# EAGLE design sqm-dis (EAGLE 6.4)
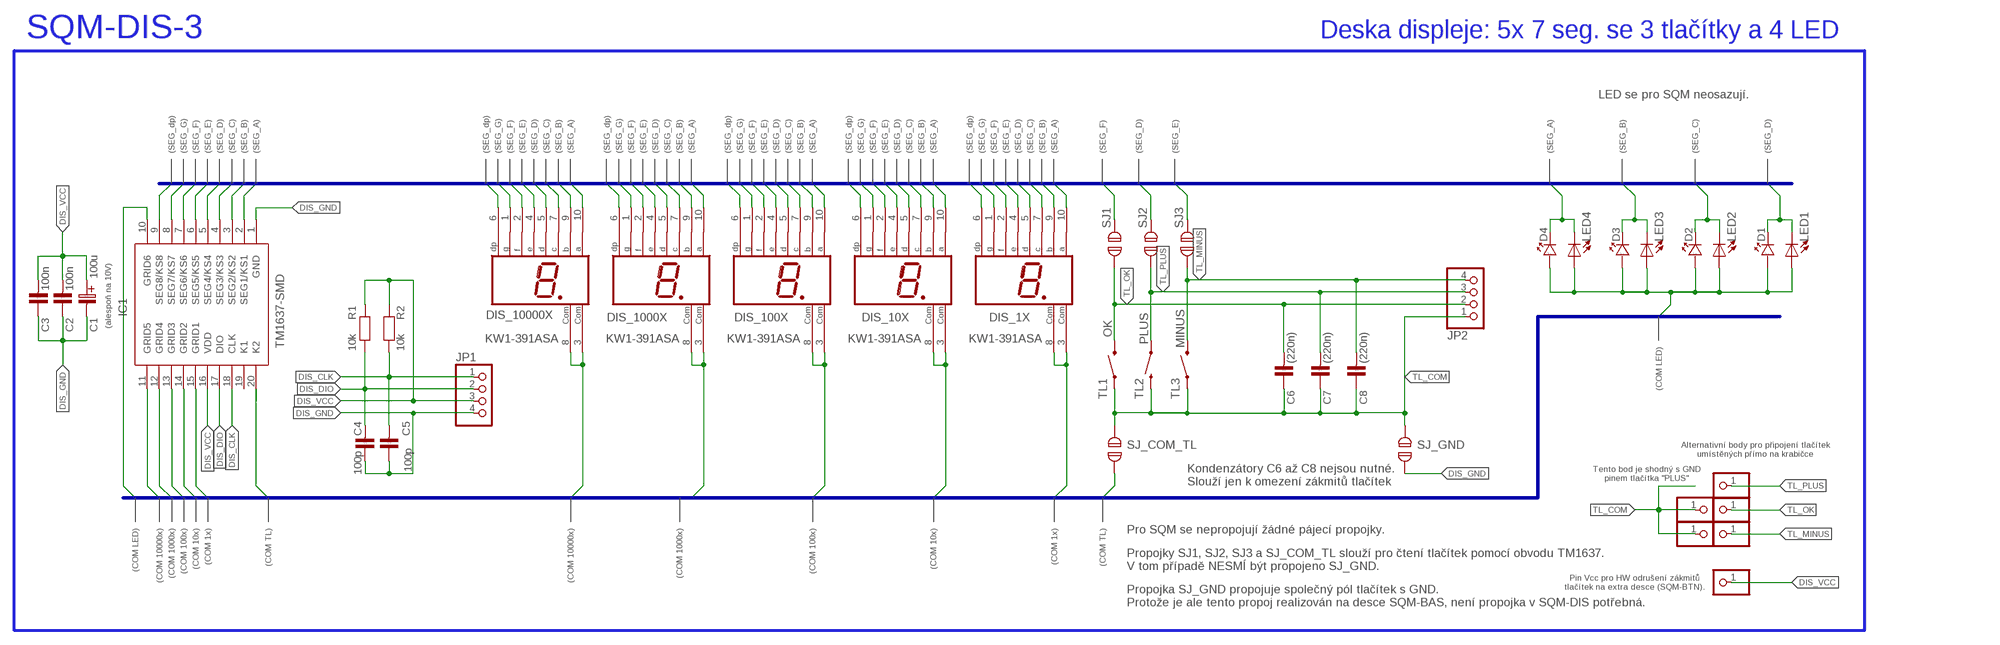
[diagram p0: schematic, sheet 1]

## Parts
C1  100u  C-ELEKTROLYT_2,5  [C-EL_2,5]
C2  100n  C-KERAMIK_SMD_0805  [0805]
C3  100n  C-KERAMIK_SMD_0805  [0805]
C4  100p  C-KERAMIK_SMD_0805  [0805]
C5  100p  C-KERAMIK_SMD_0805  [0805]
C6  (220n)  C-KERAMIK_SMD_0805  [0805]
C7  (220n)  C-KERAMIK_SMD_0805  [0805]
C8  (220n)  C-KERAMIK_SMD_0805  [0805]
D1  LED_3  [LED_3]
D2  LED_3  [LED_3]
D3  LED_3  [LED_3]
D4  LED_3  [LED_3]
DIS_1X  KW1-391ASA  SC39-11SRWA  [HDSP-E]
DIS_10X  KW1-391ASA  SC39-11SRWA  [HDSP-E]
DIS_100X  KW1-391ASA  SC39-11SRWA  [HDSP-E]
DIS_1000X  KW1-391ASA  SC39-11SRWA  [HDSP-E]
DIS_10000X  KW1-391ASA  SC39-11SRWA  [HDSP-E]
IC1  TM1637-SMD  TM1637__SOP_  [SOIC127P1045X280-20N]
JP1  PINHD-1X4  [1X04]
JP2  PINHD-1X4  [1X04]
JP3  PINHD-1X1  [1X01]
JP4  PINHD-1X1  [1X01]
JP5  PINHD-1X1  [1X01]
JP6  PINHD-1X1  [1X01]
JP7  PINHD-1X1  [1X01]
JP8  PINHD-1X1  [1X01]
LED1  LEDCHIP-LED0805  [CHIP-LED0805]
LED2  LEDCHIP-LED0805  [CHIP-LED0805]
LED3  LEDCHIP-LED0805  [CHIP-LED0805]
LED4  LEDCHIP-LED0805  [CHIP-LED0805]
R1  10k  R_SMD_0805  [0805]
R2  10k  R_SMD_0805  [0805]
SJ1  SJ  SOLDERJUMPER  [SJ_2S-NO]
SJ2  SJ  SOLDERJUMPER  [SJ_2S-NO]
SJ3  SJ  SOLDERJUMPER  [SJ_2S-NO]
SJ_COM_TL  SJ  SOLDERJUMPER  [SJ_2S-NO]
SJ_GND  SJ  SOLDERJUMPER  [SJ_2S-NO]
TL1  OK  MOMENTARY-SWITCH-SPST-PTH-6.0MM  [TACTILE_SWITCH_PTH_6.0MM]
TL2  PLUS  MOMENTARY-SWITCH-SPST-PTH-6.0MM  [TACTILE_SWITCH_PTH_6.0MM]
TL3  MINUS  MOMENTARY-SWITCH-SPST-PTH-6.0MM  [TACTILE_SWITCH_PTH_6.0MM]

## Nets
COM_BUS0: DIS_1X.3(COM) DIS_1X.8(COM) IC1.15(GRID1)
COM_BUS1: DIS_10X.3(COM) DIS_10X.8(COM) IC1.14(GRID2)
COM_BUS2: DIS_100X.3(COM) DIS_100X.8(COM) IC1.13(GRID3)
COM_BUS3: DIS_1000X.3(COM) DIS_1000X.8(COM) IC1.12(GRID4)
COM_BUS4: DIS_10000X.3(COM) DIS_10000X.8(COM) IC1.11(GRID5)
COM_BUS5: IC1.20(K2) SJ_COM_TL.1
COM_BUS6: D1.A D2.A D3.A D4.A IC1.10(GRID6) LED1.A LED2.A LED3.A LED4.A
DIS_CLK: C5.2 IC1.18(CLK) JP1.1 R2.1
DIS_DIO: C4.2 IC1.17(DIO) JP1.2 R1.1
DIS_GND: C1.C-(C_EL-) C2.1 C3.1 C4.1 C5.1 IC1.1(GND) JP1.4 SJ_GND.1
DIS_VCC: C1.C+(C_EL+) C2.2 C3.2 IC1.16(VDD) JP1.3 JP3.1 R1.2 R2.2
SEG_BUS0: D4.K DIS_1X.10(A) DIS_10X.10(A) DIS_100X.10(A) DIS_1000X.10(A) DIS_10000X.10(A) IC1.2(SEG1/KS1) LED4.C
SEG_BUS1: D3.K DIS_1X.9(B) DIS_10X.9(B) DIS_100X.9(B) DIS_1000X.9(B) DIS_10000X.9(B) IC1.3(SEG2/KS2) LED3.C
SEG_BUS2: D2.K DIS_1X.7(C) DIS_10X.7(C) DIS_100X.7(C) DIS_1000X.7(C) DIS_10000X.7(C) IC1.4(SEG3/KS3) LED2.C
SEG_BUS3: D1.K DIS_1X.5(D) DIS_10X.5(D) DIS_100X.5(D) DIS_1000X.5(D) DIS_10000X.5(D) IC1.5(SEG4/KS4) LED1.C SJ2.2
SEG_BUS4: DIS_1X.4(E) DIS_10X.4(E) DIS_100X.4(E) DIS_1000X.4(E) DIS_10000X.4(E) IC1.6(SEG5/KS5) SJ3.2
SEG_BUS5: DIS_1X.2(F) DIS_10X.2(F) DIS_100X.2(F) DIS_1000X.2(F) DIS_10000X.2(F) IC1.7(SEG6/KS6) SJ1.2
SEG_BUS6: DIS_1X.1(G) DIS_10X.1(G) DIS_100X.1(G) DIS_1000X.1(G) DIS_10000X.1(G) IC1.8(SEG7/KS7)
SEG_BUS7: DIS_1X.6(DP) DIS_10X.6(DP) DIS_100X.6(DP) DIS_1000X.6(DP) DIS_10000X.6(DP) IC1.9(SEG8/KS8)
TL_COM: C6.1 C7.1 C8.1 JP2.1 JP7.1 JP8.1 SJ_COM_TL.2 SJ_GND.2 TL1.1 TL2.3 TL3.1
TL_MINUS: C8.2 JP2.4 JP6.1 SJ3.1 TL3.3
TL_OK: C6.2 JP2.2 JP4.1 SJ1.1 TL1.3
TL_PLUS: C7.2 JP2.3 JP5.1 SJ2.1 TL2.1
Unconnected: IC1.19(K1)

## Buses
SEG_BUS[0..7]
COM_BUS[0..6]

## Notes on the sheet
- SQM-DIS-3 | Deska displeje: 5x 7 seg. se 3 tlačítky a 4 LED
- LED se pro SQM neosazují.
- (SEG_dp) | (SEG_G) | (SEG_F) | (SEG_E) | (SEG_D) | (SEG_C) | (SEG_B) | (SEG_A) | (SEG_dp) | (SEG_G) | (SEG_F) | (SEG_E) | (SEG_D) | (SEG_C) | (SEG_B) | (SEG_A) | (SEG_dp) | (SEG_G) | (SEG_F) | (SEG_E) | (SEG_D) | (SEG_C) | (SEG_B) | (SEG_A) | (SEG_dp) | (SEG_G) | (SEG_F) | (SEG_E) | (SEG_D) | (SEG_C) | (SEG_B) | (SEG_A) | (SEG_dp) | (SEG_G) | (SEG_F) | (SEG_E) | (SEG_D) | (SEG_C) | (SEG_B) | (SEG_A) | (SEG_dp) | (SEG_G) | (SEG_F) | (SEG_E) | (SEG_D) | (SEG_C) | (SEG_B) | (SEG_A) | (SEG_F) | (SEG_D) | (SEG_E) | (SEG_A) | (SEG_B) | (SEG_C) | (SEG_D)
- SJ1 | SJ2 | SJ3
- (alespoň na 10V)
- (COM LED)
- SJ_COM_TL | SJ_GND
- Alternativní body pro připojení tlačítek
  umístěných přímo na krabičce
- Tento bod je shodný s GND
  pinem tlačítka "PLUS"
- Kondenzátory C6 až C8 nejsou nutné.
  Slouží jen k omezení zákmitů tlačítek
- (COM LED) | (COM 10000x) | (COM 1000x) | (COM 100x) | (COM 10x) | (COM 1x) | (COM TL) | (COM 10000x) | (COM 1000x) | (COM 100x) | (COM 10x) | (COM 1x) | (COM TL)
- Pro SQM se nepropojují žádné pájecí propojky.
- Propojky SJ1, SJ2, SJ3 a SJ_COM_TL slouží pro čtení tlačítek pomocí obvodu TM1637.
  V tom případě NESMÍ být propojeno SJ_GND.
- Pin Vcc pro HW odrušení zákmitů
  tlačítek na extra desce (SQM-BTN).
- Propojka SJ_GND propojuje společný pól tlačítek s GND.
  Protože je ale tento propoj realizován na desce SQM-BAS, není propojka v SQM-DIS potřebná.

## Library data of the parts
C1 = #PaJa_30:C-ELEKTROLYT: Kondenzator - elektrolyticky
C2-C8 = #PaJa_30:C-KERAMIK: Kondenzator - keramicky
D1-D4 = #PaJa_30:LED: LED - jednobarevna
DIS_1X DIS_10X DIS_100X DIS_1000X DIS_10000X = display-hp:SC39-11SRWA: SINGLE DIGIT NUMERIC DISPLAY 9.9mm (0.39INCH) Source: SC39-11SRWA.pdf; OC_FARNELL: unknown; OC_NEWARK: unknown
IC1 = TM1637__SOP_:TM1637__SOP_: LED Drive Control Special Circuit Source: Datasheet <https://www.mcielectronics.cl/website_MCI/static/documents/Datasheet_TM1637.pdf>; DESCRIPTION: LED Drive Control Special Circuit; HEIGHT: 2.8mm; MANUFACTURER_NAME: TITAN MICRO ELECTRONICS; MANUFACTURER_PART_NUMBER: TM1637 (SOP)
JP1 JP2 = pinhead:PINHD-1X4: PIN HEADER
JP3-JP8 = pinhead:PINHD-1X1: PIN HEADER
LED1-LED4 = adafruit:LED: LED OSRAM: - CHIPLED LG R971, LG N971, LY N971, LG Q971, LY Q971, LO R971, LY R971 LH N974, LH R974 LS Q976, LO Q976, LY Q976 LO Q996 - Hyper CHIPLED LW Q18S LB Q993, LB Q99A, LB R99A - SideLED LS A670, LO A670, LY A670, LG A670, LP A670 LB A673, LV A673, LT A673, LW A673 LH A674 LY A675 LS A676, LA A676, LO A676, LY A676, LW A676 LS A679, LY A679, LG A679 - Hyper Micro SIDELED® LS Y876, LA Y876, LO Y876, LY Y876 LT Y87S - SmartLED LW L88C, LW L88S LB L89C, LB L89S, LG L890 LS L89K, LO L89K, LY L89K LS L896, LA L896, LO L896, LY L896 - TOPLED LS T670, LO T670, LY T670, LG T670, LP T670 LSG T670, LSP T670, LSY T670, LOP T670, LYG T670 LG T671, LOG T671, LSG T671 LB T673, LV T673, LT T673, LW T673 LH T674 LS T676, LA T676, LO T676, LY T676, LB T676, LH T676, LSB T676, LW T676 LB T67C, LV T67C, LT T67C, LS T67K, LO T67K, LY T67K, LW E67C LS E67B, LA E67B, LO E67B, LY E67B, LB E67C, LV E67C, LT E67C LW T67C LS T679, LY T679, LG T679 LS T770, LO T770, LY T770, LG T770, LP T770 LB T773, LV T773, LT T773, LW T773 LH T774 LS E675, LA E675, LY E675, LS T675 LS T776, LA T776, LO T776, LY T776, LB T776 LHGB T686 LT T68C, LB T68C - Hyper Mini TOPLED® LB M676 - Mini TOPLED Santana® LG M470 LS M47K, LO M47K, LY M47K Source: http://www.osram.convergy.de/
R1 R2 = #PaJa_30:R: Rezistor
SJ1-SJ3 SJ_COM_TL SJ_GND = solderjump:SOLDERJUMPER: Pájecí propojka
TL1-TL3 = SparkFun-Switches:MOMENTARY-SWITCH-SPST: Momentary Switch (Pushbutton) - SPST Normally-open (NO) SPST momentary switches (buttons, pushbuttons). Variants PTH-12MM - 12mm square, through-hole Momentary Pushbutton Switch - 12mm Square <https://www.sparkfun.com/products/9190> (COM-09190) PTH-6.0MM, PTH-6.0MM-KIT - 6.0mm square, through-hole Mini Pushbutton Switch <https://www.sparkfun.com/products/97> (COM-00097) KIT package intended for soldering kit's - only one side of pads' copper is exposed. PTH-RIGHT-ANGLE-KIT - Right-angle, through-hole Right Angle Tactile Button <https://www.sparkfun.com/products/10791> - Used on SparkFun BigTime Watch Kit <https://www.sparkfun.com/products/11734> SMD-12MM - 12mm square, surface-mount Tactile Button - SMD (12mm) <https://www.sparkfun.com/products/12993> (COM-12993) Used on SparkFun PicoBoard <https://www.sparkfun.com/products/11888> SMD-4.5MM - 4.5mm Square Trackball Switch Used on SparkFun Blackberry Trackballer Breakout <https://www.sparkfun.com/products/13169> SMD-4.6MMX2.8MM - 4.60mm x 2.80mm, surface mount Used on SparkFun SAMD21 Mini Breakout <https://www.sparkfun.com/products/13664> SMD-5.2MM, SMD-5.2-REDUNDANT - 5.2mm square, surface-mount Mini Pushbutton Switch - SMD <https://www.sparkfun.com/products/8720> (COM-08720) Used on Arduino Pro Mini <https://www.sparkfun.com/products/11114> REDUNDANT package connects both switch circuits together SMD-6.0X3.5MM - 6.0 x 3.5mm, surface mount Momentary Reset Switch SMD <https://www.sparkfun.com/products/8229> (COM-08229) SMD-6.2MM-TALL - 6.2mm square, surface mount Tactile Button - SMD (6mm) <https://www.sparkfun.com/products/12992> Used on SparkFun Digital Sandbox <https://www.sparkfun.com/products/12651> SMD-RIGHT-ANGLE - Right-angle, surface mount Used on SparkFun Block for Intel® Edison - Arduino <https://www.sparkfun.com/products/13036>; PROD_ID: SWCH-08441; SF_SKU: COM-00097

## Board
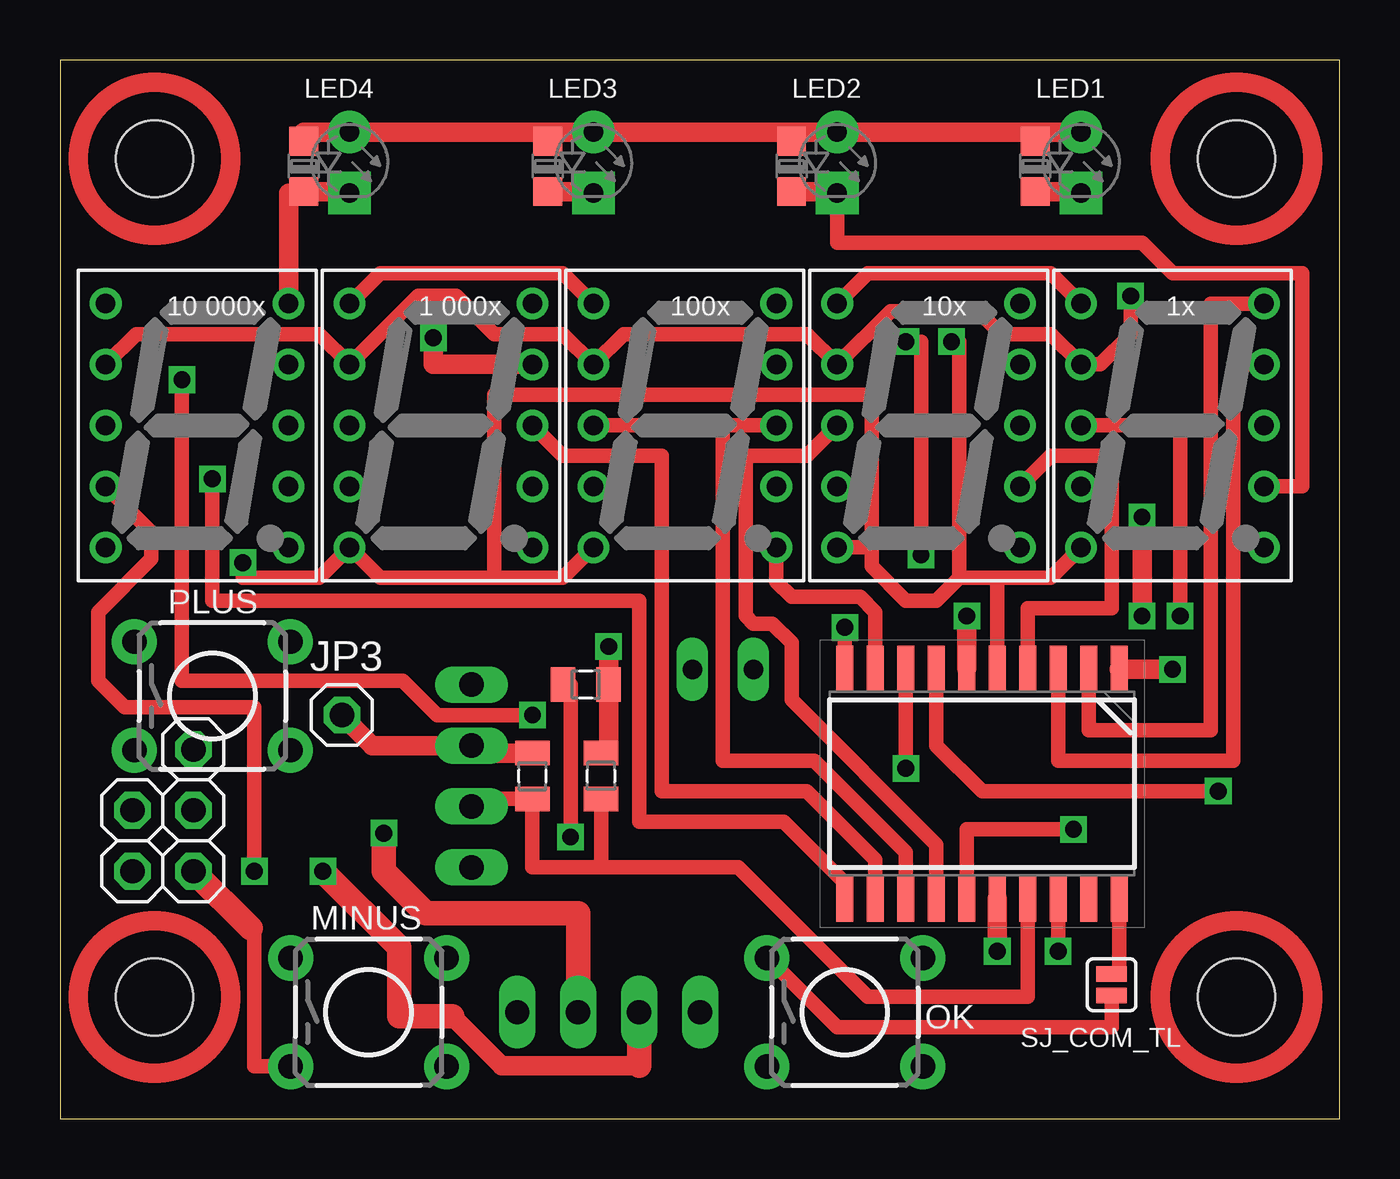
[diagram p1: board, top side]
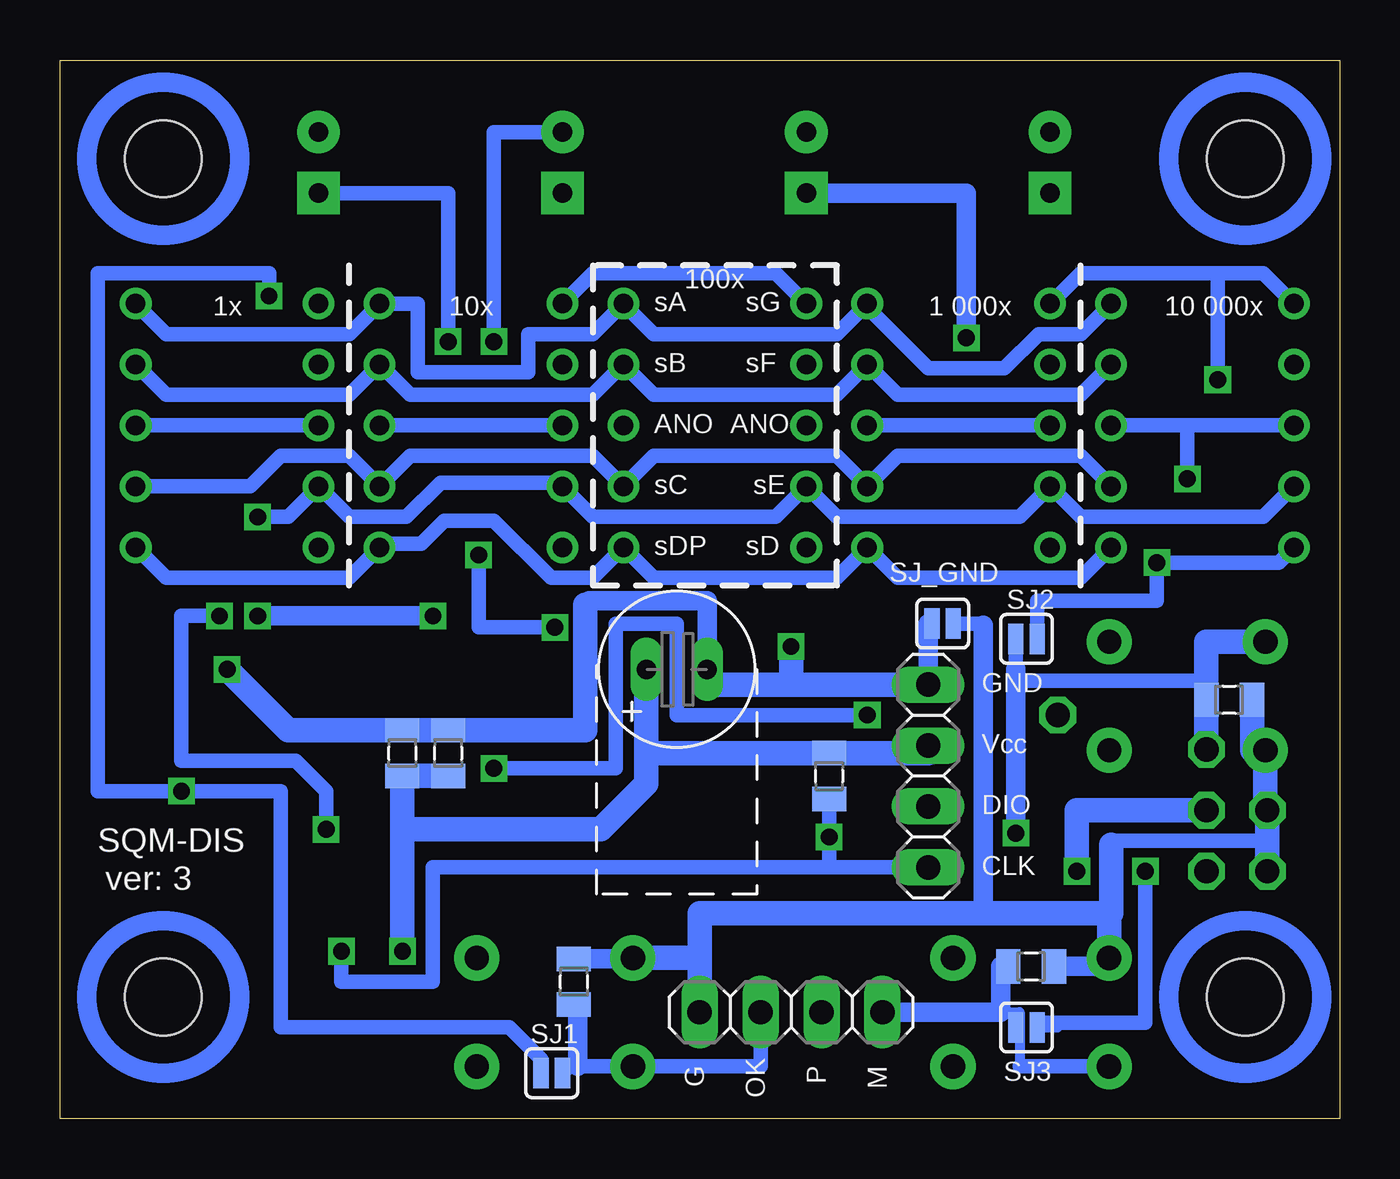
[diagram p2: board, bottom side, seen from below]

Size 53.32 x 44.12 mm. Coordinates in mm from the lower left corner, seen from the top.
Outline: 0,0 53.32,0 53.32,44.12 0,44.12 0,0
Copper layers (1*16): Top 0.035mm / dielectric 1.5mm / Bottom 0.035mm
Design rules "default *": minimum track width 10mil, minimum drill 24mil, track to track 8mil, track to pad 8mil, pad to pad 8mil, via to via 8mil, smd to smd 8mil, copper to edge 40mil, drill to drill 8mil, minimum pad ring 10mil, minimum via ring 8mil, stop-mask expansion 4mil, vias tented up to drill 0mil, thermal gap 10mil
Holes 3.2 mm at 49.02,5.08 3.94,40.01 49.02,40.01 3.94,5.08

### Footprints (pad centres in the part's own frame; a part is rotated, then mirrored left to right if it is on the bottom)
C-EL_2,5 = drill 0.813 pad 1.27 long: C+ -1.27,0; C- 1.27,0
0805 = smd 1.016 x 1.422: 1 -0.953,0; 2 0.953,0
LED_3 = drill 0.813 pad 1.778: A -1.27,0 | drill 0.813 pad 1.778 square: K 1.27,0
HDSP-E = drill 0.813: 1 -3.81,5.08; 2 -3.81,2.54; 3 -3.81,0; 4 -3.81,-2.54; 5 -3.81,-5.08; 6 3.81,-5.08; 7 3.81,-2.54; 8 3.81,0; 9 3.81,2.54; 10 3.81,5.08
SOIC127P1045X280-20N = smd 1.9 x 0.7: 1 -4.8,5.715; 2 -4.8,4.445; 3 -4.8,3.175; 4 -4.8,1.905; 5 -4.8,0.635; 6 -4.8,-0.635; 7 -4.8,-1.905; 8 -4.8,-3.175; 9 -4.8,-4.445; 10 -4.8,-5.715; 11 4.8,-5.715; 12 4.8,-4.445; 13 4.8,-3.175; 14 4.8,-1.905; 15 4.8,-0.635; 16 4.8,0.635; 17 4.8,1.905; 18 4.8,3.175; 19 4.8,4.445; 20 4.8,5.715
1X04 = drill 1.016 long: 1 -3.81,0; 2 -1.27,0; 3 1.27,0; 4 3.81,0
1X01 = drill 1.016 octagon: 1 0,0
CHIP-LED0805 = smd 1.2 x 1.2: A 0,-1.05; C 0,1.05
SJ_2S-NO = smd 0.635 x 1.27: 1 0,0; 2 0.889,0
TACTILE_SWITCH_PTH_6.0MM = drill 1.016 pad 1.88: 1 -3.251,2.261; 2 3.251,2.261; 3 -3.251,-2.261; 4 3.251,-2.261

### Placement (x,y rotation side)
C1  27.62,18.73 0 bottom
C2  39.05,15.24 270 bottom
C3  37.15,15.24 270 bottom
C4  22.54,14.29 270 top
C5  21.91,18.1 180 top
C6  31.91,5.71 270 bottom
C7  4.6,17.46 180 bottom
C8  12.86,6.35 180 bottom
D1  42.55,39.85 270 top
D2  32.38,39.85 270 top
D3  22.23,39.85 270 top
D4  12.06,39.85 270 top
DIS_1X  46.35,28.89 0 top
DIS_10X  36.2,28.89 0 top
DIS_100X  26.04,28.89 0 top
DIS_1000X  15.88,28.89 0 top
DIS_10000X  5.71,28.89 0 top
IC1  38.42,13.97 270 top
JP1  17.14,14.29 90 bottom
JP2  22.86,4.45 0 bottom
JP3  11.75,16.83 0 top
JP4  5.56,12.86 0 top
JP5  5.56,15.4 0 top
JP6  5.56,10.32 0 top
JP7  3.02,12.86 0 top
JP8  3.02,10.32 0 top
LED1  40.64,39.69 180 top
LED2  30.48,39.69 180 top
LED3  20.32,39.69 180 top
LED4  10.16,39.69 180 top
R1  19.68,14.29 90 top
R2  21.27,14.29 90 bottom
SJ1  32.38,1.91 180 bottom
SJ2  13.49,20 0 bottom
SJ3  13.49,3.81 0 bottom
SJ_COM_TL  43.81,6.03 270 top
SJ_GND  16.99,20.64 0 bottom
TL1  32.7,4.45 0 top
TL2  6.35,17.62 0 top
TL3  12.86,4.45 0 top

### Tracks (layer width: path | path; a pad name or v marks a point on that pad's centre or on a via)
COM_BUS0  (via drill 0.7)
  Top 0.61: DIS_1X.3 46.67,28.89 v46.67,20.95 | v42.23,12.06 37.78,12.06 IC1.15
  Bottom 0.61: v46.67,20.95 48.26,20.95 48.26,14.92 43.5,14.92 42.23,13.65 v42.23,12.06 | DIS_1X.8 DIS_1X.3
COM_BUS1
  Top 0.61: DIS_10X.3 31.11,27.62 28.57,27.62 28.57,20.95 28.89,20.64 29.69,20.64 30.48,19.84 30.48,17.46 36.51,11.43 IC1.14
  Bottom 0.61: DIS_10X.3 DIS_10X.8
COM_BUS2
  Top 0.61: 27.62,28.89 27.62,14.92 31.43,14.92 35.24,11.11 IC1.13 | 27.62,28.89 DIS_100X.3 | 27.62,28.89 DIS_100X.8
COM_BUS3
  Top 0.61: DIS_1000X.8 20.95,27.62 25.08,27.62 25.08,13.65 31.11,13.65 33.97,10.79 IC1.12
  Bottom 0.61: DIS_1000X.3 DIS_1000X.8
COM_BUS4  (via drill 0.7)
  Top 0.61: v6.35,26.67 6.35,21.59 24.13,21.59 24.13,12.38 30.16,12.38 32.7,9.84 IC1.11
  Bottom 0.61: DIS_10000X.3 6.35,28.89 | 6.35,28.89 v6.35,26.67 | DIS_10000X.8 6.35,28.89
COM_BUS5
  Top 0.61: IC1.20 44.13,6.03 SJ_COM_TL.1
COM_BUS6  (via drill 0.7)
  Top 0.61: IC1.10 v32.7,20.48 | v35.88,23.5 35.88,32.38 v35.24,32.38
  Top 0.813: D2.A D3.A 20.32,41.12 | D2.A D1.A 40.64,41.12 LED1.A | D2.A 30.48,41.12 LED2.A | 20.32,41.12 D4.A 10.16,41.12 LED4.A | 20.32,41.12 LED3.A
  Bottom 0.61: v32.7,20.48 35.88,20.48 v35.88,23.5 | v35.24,32.38 35.24,41.12 D2.A
DIS_CLK  (via drill 0.7)
  Top 0.61: IC1.18 v41.59,6.99 | C5.2 21.27,18.1 v21.27,11.75
  Bottom 0.61: v41.59,6.99 41.59,5.71 37.78,5.71 37.78,10.48 21.27,10.48 | JP1.1 21.27,10.48 | R2.1 v21.27,11.75 21.27,10.48
DIS_DIO
  Top 0.61: IC1.17 40.32,5.08 33.66,5.08 28.26,10.48 22.54,10.48 | JP1.2 17.14,13.34 R1.1 19.68,10.48 22.54,10.48 | C4.2 22.54,10.48
DIS_GND  (via drill 0.7)
  Top 0.61: IC1.1 44.13,18.73
  Top 0.813: 44.13,18.73 v46.35,18.73 | v22.86,19.68 C5.1 22.86,15.24 C4.1
  Bottom 0.61: SJ_GND.1 17.14,20.64
  Bottom 0.813: 31.43,21.43 31.27,21.59 26.35,21.59 C1.C- 26.35,18.1 26.19,18.1 | 17.14,20.64 JP1.4
  Bottom 1.016: JP1.4 C5.1 | v22.86,19.68 C5.1 | C5.1 26.19,18.1 | 31.43,21.43 31.43,16.19 C3.1 C2.1 43.81,16.19 v46.35,18.73
DIS_VCC  (via drill 0.7)
  Top 0.813: IC1.16 v39.05,6.99 | R1.2 17.14,15.24 JP1.3 13.02,15.56 JP3.1
  Bottom 1.016: v39.05,6.99 39.05,12.06 | 39.05,12.06 C2.2 C3.2 | 28.89,15.24 R2.2 17.14,15.24 JP1.3 | 28.89,15.24 28.89,13.97 30.8,12.06 39.05,12.06 | 28.89,15.24 C1.C+
SEG_BUS0
  Top 0.61: IC1.2 42.86,16.19 47.94,16.19 47.94,33.97 DIS_1X.10
  Top 0.813: D4.K 12.06,38.64 LED4.C 10.16,38.58 9.53,38.58 DIS_10000X.10
  Bottom 0.61: DIS_1X.10 48.9,32.7 41.27,32.7 DIS_10X.10 38.42,33.97 38.42,31.11 33.81,31.11 33.81,32.7 31.11,32.7 DIS_100X.10 28.57,32.7 20.95,32.7 DIS_1000X.10 19.68,33.81 17.14,31.27 13.97,31.27 12.54,32.7 10.79,32.7 DIS_10000X.10
SEG_BUS1  (via drill 0.7)
  Top 0.61: IC1.3 41.59,14.92 48.9,14.92 48.9,31.43 DIS_1X.9
  Top 0.813: LED3.C 22.23,38.64 D3.K | DIS_1000X.9 15.56,31.43 v15.56,32.54
  Bottom 0.61: DIS_10000X.9 10.79,30.16 18.41,30.16 DIS_1000X.9 20.95,30.16 28.57,30.16 DIS_100X.9 31.11,30.16 38.73,30.16 DIS_10X.9 41.27,30.16 48.9,30.16 DIS_1X.9
  Bottom 0.813: v15.56,32.54 15.56,38.58 D3.K
SEG_BUS2
  Top 0.61: IC1.4 40.32,21.27 43.81,21.27 43.81,27.62 41.27,27.62 DIS_10X.7 | D2.K 32.38,36.51 45.09,36.51 46.35,35.24 51.75,35.24 51.75,26.35 DIS_1X.7
  Top 0.813: LED2.C 32.38,38.64 D2.K
  Bottom 0.61: DIS_10000X.7 10.79,27.62 18.41,27.62 DIS_1000X.7 20.95,27.62 28.57,27.62 DIS_100X.7 31.11,27.62 38.73,27.62 DIS_10X.7 41.27,27.62 44.13,27.62 45.4,26.35 DIS_1X.7
SEG_BUS3  (via drill 0.7)
  Top 0.61: 18.1,22.54 13.34,22.54 DIS_1000X.5 10.79,22.54 7.62,22.54 v7.62,23.18 | DIS_100X.5 20.95,22.54 18.1,22.54 | DIS_10X.5 33.81,23.81 | 37.47,22.54 36.51,21.59 35.24,21.59 33.81,23.02 33.81,23.81 | 37.47,22.54 39.05,22.54 | 39.05,22.54 41.27,22.54 DIS_1X.5 41.59,22.86 | 18.1,22.54 18.1,30.16 33.81,30.16 33.81,23.81 | IC1.5 39.05,22.54 | 37.47,22.54 37.47,32.38 v37.15,32.38
  Top 0.813: LED1.C 42.55,38.64 D1.K
  Bottom 0.61: DIS_10000X.5 2.54,23.18 v7.62,23.18 7.62,21.59 12.61,21.59 SJ2.2 | v37.15,32.38 37.15,38.58 D1.K
SEG_BUS4  (via drill 0.7)
  Top 0.61: DIS_10000X.4 3.81,24.45 3.81,23.34 1.59,21.11 1.59,18.26 2.7,17.14 8.1,17.14 v8.1,10.32
  Top 0.813: IC1.6 v37.78,20.95 | v45.09,20.95 v45.09,25.08
  Bottom 0.406: SJ3.2 11.75,3.81 11.75,4.01
  Bottom 0.61: DIS_10000X.4 3.17,25.08 10.79,25.08 DIS_1000X.4 13.34,25.08 20.95,25.08 DIS_100X.4 23.5,25.08 31.11,25.08 DIS_10X.4 32.38,26.51 37.47,26.51 38.89,25.08 41.27,25.08 DIS_1X.4 43.81,25.08 v45.09,25.08 | v8.1,10.32 8.1,4.01 11.75,4.01 12.45,4.01
  Bottom 0.813: v37.78,20.95 v45.09,20.95
SEG_BUS5  (via drill 0.7)
  Top 0.61: DIS_10000X.2 3.17,32.7 10.79,32.7 DIS_1000X.2 14.92,34.29 16.51,34.29 18.1,32.7 20.95,32.7 DIS_100X.2 23.5,32.7 31.11,32.7 DIS_10X.2 34.61,33.66 38.26,33.66 39.21,32.7 41.27,32.7 DIS_1X.2 43.34,31.43 44.61,32.7 v44.61,34.29 | v48.26,13.65 38.42,13.65 36.51,15.56 IC1.7
  Bottom 0.61: v44.61,34.29 44.61,35.24 51.75,35.24 51.75,13.65 v48.26,13.65 44.13,13.65 44.13,3.81 34.61,3.81 33.27,2.48 SJ1.2
SEG_BUS6  (via drill 0.7)
  Top 0.61: DIS_1X.1 41.27,35.24 33.66,35.24 DIS_10X.1 | DIS_1000X.1 13.34,35.24 20.95,35.24 DIS_100X.1 | IC1.8 v35.24,14.61 | v5.08,30.8 5.08,18.26 14.29,18.26 15.72,16.83 v19.68,16.83
  Bottom 0.61: DIS_10000X.1 3.17,35.24 5.08,35.24 | 5.08,35.24 10.79,35.24 DIS_1000X.1 | DIS_10X.1 31.11,35.24 23.5,35.24 DIS_100X.1 | v35.24,14.61 30.16,14.61 30.16,20.64 27.62,20.64 27.62,16.83 v19.68,16.83 | v5.08,30.8 5.08,35.24
SEG_BUS7
  Top 0.61: IC1.9 33.97,21.11 33.34,21.75 30.48,21.75 29.84,22.38 DIS_100X.6
  Bottom 0.61: DIS_10000X.6 10.79,22.54 18.41,22.54 DIS_1000X.6 20.95,22.54 28.57,22.54 DIS_100X.6 31.11,22.54 32.86,22.54 35.24,24.92 37.31,24.92 38.26,23.97 39.85,23.97 DIS_10X.6 41.27,22.54 48.9,22.54 DIS_1X.6
TL_COM
  Top 0.61: TL1.1 29.49,6.71 32.38,3.81 43.81,3.81 SJ_COM_TL.2
  Bottom 0.61: SJ_GND.2 14.84,20.64 14.84,20.56 | JP8.1 3.02,11.59 9.53,11.59 9.53,11.43
  Bottom 0.813: 14.84,20.56 14.84,8.57 | C6.1 29.45,6.67 TL1.1 | C8.1 9.6,6.35 9.6,8.26
  Bottom 1.016: 9.6,8.57 9.6,8.26 TL3.1 | JP2.1 26.67,6.71 | 9.6,8.57 14.84,8.57 26.67,8.57 26.67,6.71 | 9.6,8.57 9.53,8.57 9.53,11.43 | 26.67,6.71 TL1.1 | JP8.1 JP7.1 3.1,12.86 TL2.3 3.65,15.36 C7.1
TL_MINUS
  Top 0.61: 7.94,7.94 8.1,7.94 8.1,2.18 TL3.3
  Top 1.016: JP6.1 7.94,7.94
  Bottom 0.406: 14.13,4.45 13.34,4.45 13.34,4.29 | 13.34,4.29 13.34,2.18 | SJ3.1 13.34,3.81 13.34,4.29
  Bottom 0.61: TL3.3 13.34,2.18
  Bottom 0.813: JP2.4 14.13,4.45 14.13,6.35 C8.2
TL_OK  (via drill 0.7)
  Top 0.813: 16.35,4.29 18.41,2.22 24.13,2.22
  Top 1.016: 24.13,2.22 JP2.2 | v10.95,10.32 14.13,7.14 14.13,4.29 16.35,4.29
  Bottom 0.61: SJ1.1 32.11,2.18 31.75,2.18 TL1.3 24.13,2.18 JP2.2
  Bottom 0.813: C6.2 31.75,4.76 31.75,2.18
  Bottom 1.016: JP4.1 10.95,12.86 v10.95,10.32
TL_PLUS  (via drill 0.7)
  Top 1.016: JP2.3 21.59,8.57 15.24,8.57 13.49,10.32 v13.49,11.91
  Bottom 0.61: C7.2 5.56,18.26 13.49,18.26 | SJ2.1 13.49,18.73
  Bottom 0.813: 13.49,18.73 13.49,18.26 v13.49,11.91
  Bottom 1.016: TL2.1 5.56,19.88 C7.2 JP5.1
(copper drawn outside any net)
  shapes: Bottom circle x4, Top circle x4

### Text on the board
tPlace: 10 000x | 1 000x | 100x | 10x | 1x | PLUS | MINUS | OK
bPlace: 100x | 10 000x | 1 000x | sG | sA | 10x | 1x | sF | sB | ANO | ANO | sE | sC | sD | sDP | GND | Vcc | DIO | SQM-DIS | CLK | ver: 3 | OK | M | P | G
tDocu: Displejová deska (ver. 3) pro SQM / TOP strana | Vcc | tl_PLUS | Připojení tlačítek umístěných / na horní straně krabičky. | tl_OK | tl_MINUS | LED se neosazují. / Tlačítka se neosazují. / Pájecí propojky se nepropojují.
bDocu: Displejová deska (ver. 3) pro SQM / BOT strana | Kondenzátory C6, C7 a C8 slouží k omezení zákmitů tlačítek. / Při použití kvalitních tlačítek není nutné je osazovat. | Kondenzátor C1 položit na desku, / aby nepřekážel při zasunutí do SQM-BAS. | Pájecí propojky nepropojovat. | Výšku kolíků JP1 a JP2 upravit podle potřeby / po nasazení na sloupky mezi SQM-BAS.